# EAGLE board stm v0.4 (EAGLE 9.4.2)
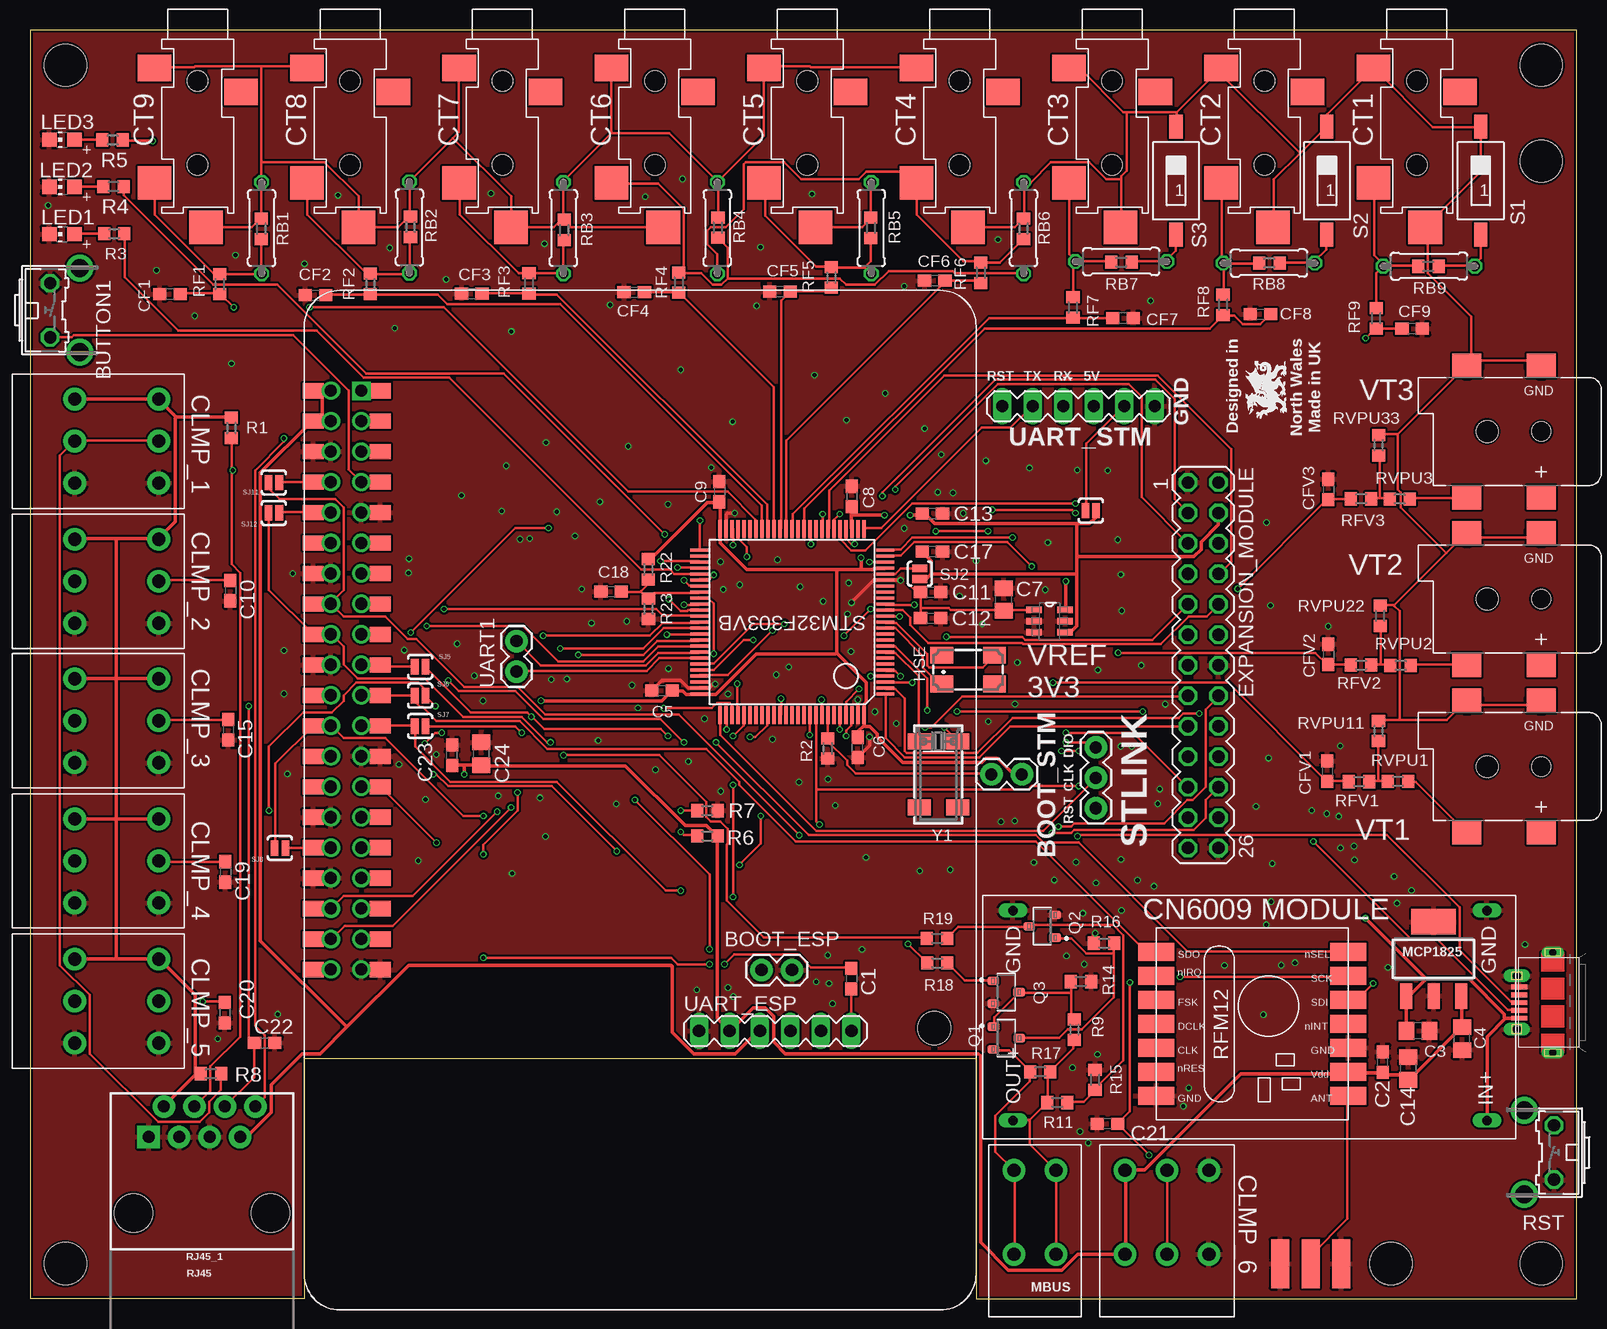
[diagram p2: board, top side]
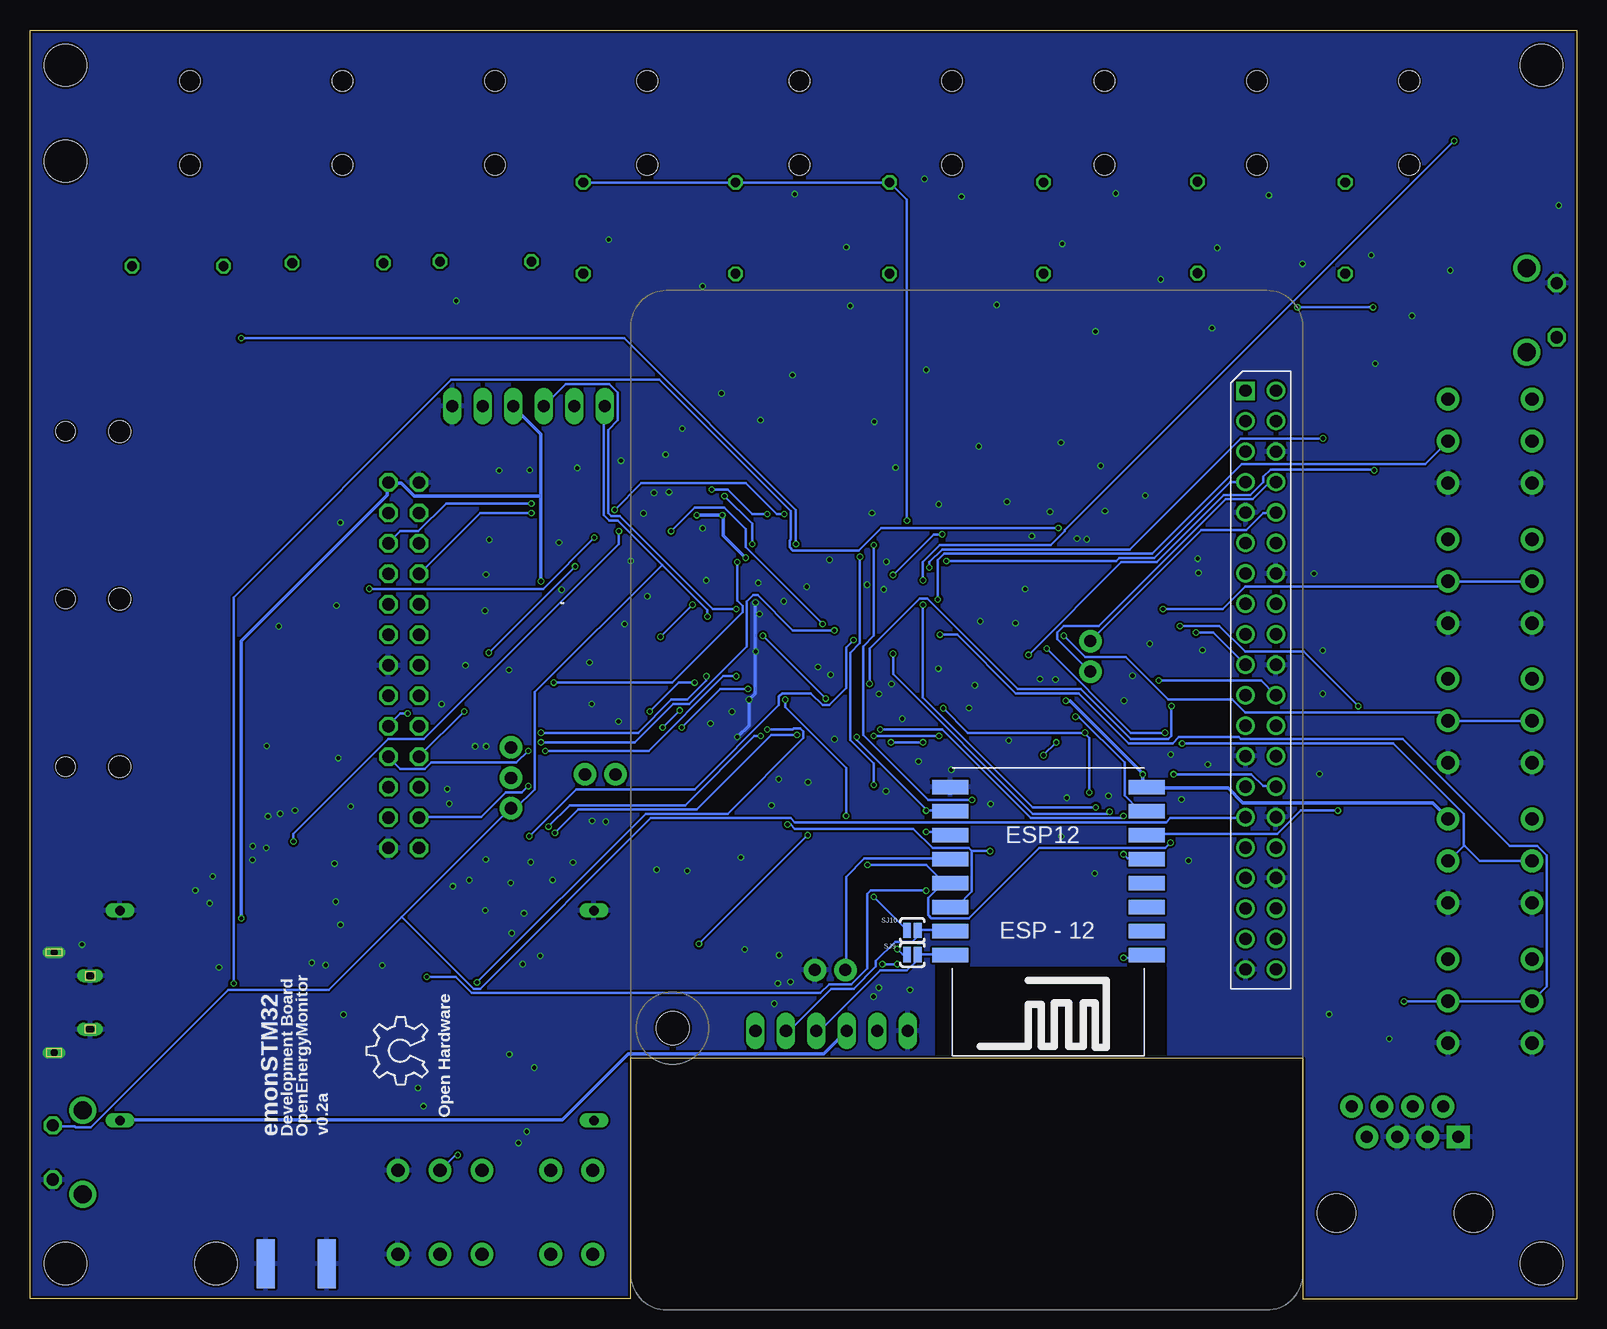
[diagram p3: board, bottom side, seen from below]

Size 128.91 x 105.79 mm. Coordinates in mm from the lower left corner, seen from the top.
Outline: 128.91,105.79 0,105.79 0,0 22.86,0 22.86,20.07 78.87,20.07 78.87,0 128.91,0 128.91,105.79
Copper layers (1*16): Top 0.035mm / dielectric 1.53mm / Bottom 0.035mm
Design rules "jlcpcb *": minimum track width 6mil, minimum drill 0.35mm, track to track 6mil, track to pad 6mil, pad to pad 7mil, via to via 8mil, smd to smd 0mil, copper to edge 8mil, drill to drill 10mil, minimum pad ring 3mil, minimum via ring 3mil, stop-mask expansion 2mil, vias tented up to drill 25mil, thermal gap 8mil
Net classes: 0 default: width 0.203 mm, drill 0.35 mm, clearance 0.152 mm; 1 power: width 0.279 mm, drill 0.35 mm, clearance 0.178 mm; 2 gnd: width 0.254 mm, drill 0.35 mm, clearance 0.152 mm
Holes 3.5 mm at 125.95,102.85 2.95,102.85 2.95,2.95 125.95,2.95 125.95,94.85 113.41,2.95
tRestrict: area 34,19.3 to 53.3,27.7
bRestrict: area 34.2,19.3 to 53.5,27.7

## Footprints (pad centres in the part's own frame; a part is rotated, then mirrored left to right if it is on the bottom)
OMNIMATE_LSF_2 = drill 1.1 pad 1.9: P$1 -3.5,-3.5; P$2 -3.5,3.5; P$3 0,-3.5; P$4 0,3.5
OMNIMATE_LSF_3 = drill 1.1 pad 1.9: P$1 -3.5,-3.5; P$2 -3.5,3.5; P$3 0,-3.5; P$4 0,3.5; P$5 3.5,-3.5; P$6 3.5,3.5
1X02 = drill 1.016 pad 1.88: 1 0,0; 2 2.54,0
B3F-31XX = drill 1.016 octagon: 1 -2.261,-1.245; 2 2.261,-1.245 | drill 1.499 pad 2.159: 3 -3.505,1.245; 4 3.505,1.245
C0603 = smd 1.1 x 1: 1 -0.85,0; 2 0.85,0
C0805 = smd 1.3 x 1.5: 1 -0.95,0; 2 0.95,0
STEREO_SMT = smd 2.8 x 2.2: P$1 -3.6,-2.4; P$3 3.6,-4.4 | smd 2.8 x 2.8: P$2 -3.6,-12; P$4 0.7,-15.7 | hole 1.7: 0,-3.5; 0,-10.5
ESP12-SMD = smd 3 x 1.2: ADC -8.3,3.8; CH_PD -8.3,1.8; GND 8.1,-8.2; GPIO0 8.1,-2.2; GPIO2 8.1,-4.2; GPIO4 8.1,-0.2; GPIO5 8.1,1.8; GPIO12 -8.3,-4.2; GPIO13 -8.3,-6.2; GPIO14 -8.3,-2.2; GPIO15 8.1,-6.2; GPIO16 -8.3,-0.2; RESET -8.3,5.8; RXD0 8.1,3.8; TXD0 8.1,5.8; VCC -8.3,-8.2
MA13-2 = drill 1.016 octagon: 1 -15.24,-1.27; 2 -15.24,1.27; 3 -12.7,-1.27; 4 -12.7,1.27; 5 -10.16,-1.27; 6 -10.16,1.27; 7 -7.62,-1.27; 8 -7.62,1.27; 9 -5.08,-1.27; 10 -5.08,1.27; 11 -2.54,-1.27; 12 -2.54,1.27; 13 0,-1.27; 14 0,1.27; 15 2.54,-1.27; 16 2.54,1.27; 17 5.08,-1.27; 18 5.08,1.27; 19 7.62,-1.27; 20 7.62,1.27; 21 10.16,-1.27; 22 10.16,1.27; 23 12.7,-1.27; 24 12.7,1.27; 25 15.24,-1.27; 26 15.24,1.27
CTS406 = smd 1.9 x 1.4: 1 -2.2,-1.2; 2 2.2,-1.2; 3 2.2,1.2; 4 -2.2,1.2
SMA-EDGE = smd 1.524 x 4.064: GND@0 0,0; GND@1 5.08,0; SIG 2.54,0 | smd 1.524 x 4.064 bottom: GND@2 0,0; GND@3 5.08,0
CHIP-LED0805 = smd 1.2 x 1.2: A 0,-1.05; C 0,1.05
SOT-223 = smd 1 x 2.1: 1 -2.3,-3.1; 2 0,-3.1; 3 2.3,-3.1 | smd 3.7 x 2.1: 4 0,3.1
RPI3MIRROR2 = drill 1.016 square: P$1 8.37,4.775 | drill 1.016: P$2 8.357,2.233; P$3 10.897,4.773; P$4 10.897,2.233; P$5 13.437,4.773; P$6 13.437,2.233; P$7 15.977,4.773; P$8 15.977,2.233; P$9 18.517,4.773; P$10 18.517,2.233; P$11 21.057,4.773; P$12 21.057,2.233; P$13 23.597,4.773; P$14 23.597,2.233; P$15 26.137,4.773; P$16 26.137,2.233; P$17 28.677,4.773; P$18 28.677,2.233; P$19 31.217,4.773; P$20 31.217,2.233; P$21 33.757,4.773; P$22 33.757,2.233; P$23 36.297,4.773; P$24 36.297,2.233; P$25 38.837,4.773; P$26 38.837,2.233; P$27 41.377,4.773; P$28 41.377,2.233; P$29 43.917,4.773; P$30 43.917,2.233; P$31 46.457,4.773; P$32 46.457,2.233; P$33 48.997,4.773; P$34 48.997,2.233; P$35 51.537,4.773; P$36 51.537,2.233; P$37 54.077,4.773; P$38 54.077,2.233; P$39 56.617,4.773; P$40 56.617,2.233 | smd 1.27 x 1.778: P$41 8.371,6.351; P$42 8.371,0.763; P$43 10.911,6.351; P$44 10.911,0.763; P$45 13.451,6.351; P$46 13.451,0.763; P$47 15.991,6.351; P$48 15.991,0.763; P$49 18.531,6.351; P$50 18.531,0.763; P$51 21.071,6.351; P$52 21.071,0.763; P$53 23.611,6.351; P$54 23.611,0.763; P$55 26.151,6.351; P$56 26.151,0.763; P$57 28.691,6.351; P$58 28.691,0.763; P$59 31.231,6.351; P$60 31.231,0.763; P$61 33.771,6.351; P$62 33.771,0.763; P$63 36.311,6.351; P$64 36.311,0.763; P$65 38.851,6.351; P$66 38.851,0.763; P$67 41.391,6.351; P$68 41.391,0.763; P$69 43.931,6.351; P$70 43.931,0.763; P$71 46.471,6.351; P$72 46.471,0.763; P$73 49.011,6.351; P$74 49.011,0.763; P$75 51.551,6.351; P$76 51.551,0.763; P$77 54.091,6.351; P$78 54.091,0.763; P$79 56.631,6.351; P$80 56.631,0.763 | hole 2.75: 61.5,52.505
SOT23 = smd 0.71 x 0.96: 1 -0.95,-1.075; 2 0.95,-1.075; 3 0,1.075
R0603 = smd 1 x 1.1: 1 -0.85,0; 2 0.85,0
0207/7 = drill 0.813 octagon: 1 -3.81,0; 2 3.81,0
RFM12 = smd 1.5 x 3: 1 -5,-10; 2 -3,-10; 3 -1,-10; 4 1,-10; 5 3,-10; 6 5,-10; 7 7,-10; 8 7,6; 9 5,6; 10 3,6; 11 1,6; 12 -1,6; 13 -3,6; 14 -5,6
RJ45-8 = drill 1 pad 1.88 square: 1 -4.445,6.35 | drill 1 pad 1.88: 2 -3.175,8.89; 3 -1.905,6.35; 4 -0.635,8.89; 5 0.635,6.35; 6 1.905,8.89; 7 3.175,6.35; 8 4.445,8.89 | hole 3.2: -5.715,0; 5.715,0
SMS-001 = smd 1.092 x 2.007: 1 0,-4.496; 2 0,4.496
SJ_2S-NO = smd 0.635 x 1.27: 1 -0.45,0; 2 0.45,0
1X03 = drill 1.016 pad 1.88: 1 0,0; 2 2.54,0; 3 5.08,0
TQFP100 = smd 0.27 x 1.5: 1 -6,-7.75; 2 -5.5,-7.75; 3 -5,-7.75; 4 -4.5,-7.75; 5 -4,-7.75; 6 -3.5,-7.75; 7 -3,-7.75; 8 -2.5,-7.75; 9 -2,-7.75; 10 -1.5,-7.75; 11 -1,-7.75; 12 -0.5,-7.75; 13 0,-7.75; 14 0.5,-7.75; 15 1,-7.75; 16 1.5,-7.75; 17 2,-7.75; 18 2.5,-7.75; 19 3,-7.75; 20 3.5,-7.75; 21 4,-7.75; 22 4.5,-7.75; 23 5,-7.75; 24 5.5,-7.75; 25 6,-7.75; 51 6,7.75; 52 5.5,7.75; 53 5,7.75; 54 4.5,7.75; 55 4,7.75; 56 3.5,7.75; 57 3,7.75; 58 2.5,7.75; 59 2,7.75; 60 1.5,7.75; 61 1,7.75; 62 0.5,7.75; 63 0,7.75; 64 -0.5,7.75; 65 -1,7.75; 66 -1.5,7.75; 67 -2,7.75; 68 -2.5,7.75; 69 -3,7.75; 70 -3.5,7.75; 71 -4,7.75; 72 -4.5,7.75; 73 -5,7.75; 74 -5.5,7.75; 75 -6,7.75 | smd 1.5 x 0.27: 26 7.75,-6; 27 7.75,-5.5; 28 7.75,-5; 29 7.75,-4.5; 30 7.75,-4; 31 7.75,-3.5; 32 7.75,-3; 33 7.75,-2.5; 34 7.75,-2; 35 7.75,-1.5; 36 7.75,-1; 37 7.75,-0.5; 38 7.75,0; 39 7.75,0.5; 40 7.75,1; 41 7.75,1.5; 42 7.75,2; 43 7.75,2.5; 44 7.75,3; 45 7.75,3.5; 46 7.75,4; 47 7.75,4.5; 48 7.75,5; 49 7.75,5.5; 50 7.75,6; 76 -7.75,6; 77 -7.75,5.5; 78 -7.75,5; 79 -7.75,4.5; 80 -7.75,4; 81 -7.75,3.5; 82 -7.75,3; 83 -7.75,2.5; 84 -7.75,2; 85 -7.75,1.5; 86 -7.75,1; 87 -7.75,0.5; 88 -7.75,0; 89 -7.75,-0.5; 90 -7.75,-1; 91 -7.75,-1.5; 92 -7.75,-2; 93 -7.75,-2.5; 94 -7.75,-3; 95 -7.75,-3.5; 96 -7.75,-4; 97 -7.75,-4.5; 98 -7.75,-5; 99 -7.75,-5.5; 100 -7.75,-6
BOOST = drill 0.8 long: IN+ 17.5,39.5; OUT+ 17.5,0; P$1 0,0; P$2 0,39.5
MA06-1 = drill 1.016 long: 1 -6.35,0; 2 -3.81,0; 3 -1.27,0; 4 1.27,0; 5 3.81,0; 6 6.35,0
47589-0001 = smd 1.35 x 0.4: 1 2.8,1.3; 2 2.8,0.65; 3 2.8,0; 4 2.8,-0.65; 5 2.8,-1.3 | drill 0.6 pad 0.95 long: CASING1 0,4.175; CASING2 0,-4.175 | drill 0.7 pad 1.1 long: CASING3 3,2.225; CASING4 3,-2.225
SOT95P280X145-6N = smd 1.27 x 0.559: 1 -1.295,0.94; 2 -1.295,0; 3 -1.295,-0.94; 4 1.295,-0.94; 5 1.295,0; 6 1.295,0.94
DCJACK_2MM_SMT = smd 2.4 x 2: GND 0,-5.5; GNDBREAK 6.2,-5.5; PWR1 0,5.5; PWR2 6.2,5.5 | hole 1.6: 0,0 | hole 1.8: 4.5,0
CRYSTAL_8X3.8 = smd 1.3 x 1.9: P$1 -2.75,-1.6; P$2 2.75,-1.6; P$3 2.75,1.6; P$4 -2.75,1.6

## Placement (x,y rotation side)
2POLE_MBUS  OMNIMATE_LSF_2  [OMNIMATE_LSF_2]  85.5,7.24 0 top
3POLE_1  OMNIMATE_LSF_3  [OMNIMATE_LSF_3]  7.23,71.51 270 top
3POLE_2  OMNIMATE_LSF_3  [OMNIMATE_LSF_3]  7.23,59.83 270 top
3POLE_3  OMNIMATE_LSF_3  [OMNIMATE_LSF_3]  7.23,48.2 270 top
3POLE_4  OMNIMATE_LSF_3  [OMNIMATE_LSF_3]  7.23,36.52 270 top
3POLE_5  OMNIMATE_LSF_3  [OMNIMATE_LSF_3]  7.23,24.83 270 top
3POLE_6  OMNIMATE_LSF_3  [OMNIMATE_LSF_3]  94.74,7.24 0 top
BOOT_ESP  [1X02]  60.96,27.43 0 top
BOOT_STM  [1X02]  80.12,43.74 0 top
BUTTON1  [B3F-31XX]  2.92,82.42 270 top
C1  100nF  [C0603]  68.45,26.72 270 top
C2  100nF  [C0603]  112.73,19.75 90 top
C3  4.7uF  [C0805]  115.67,22.35 180 top
C4  4.7uF  [C0805]  119.33,21.71 90 top
C5  100nF  [C0603]  52.67,50.73 0 top
C6  100nF  [C0603]  68.96,45.98 90 top
C7  1uF  [C0805]  81.16,58.31 90 top
C8  100nF  [C0603]  68.48,66.91 270 top
C9  100nF  [C0603]  57.45,67.31 270 top
C10  100nF  [C0603]  16.7,59.06 270 top
C11  10nF  [C0603]  75.06,58.93 0 top
C12  1uF  [C0603]  75.06,56.77 0 top
C13  10nF  [C0603]  75.19,65.49 0 top
C14  1uF  [C0805]  114.87,19.22 90 top
C15  100nF  [C0603]  16.53,47.45 270 top
C17  1uF  [C0603]  75.19,62.32 0 top
C18  10uF  [C0603]  48.43,58.97 0 top
C19  100nF  [C0603]  16.29,35.6 270 top
C20  100nF  [C0603]  16.22,23.88 270 top
C21  100nF  [C0603]  89.79,14.61 180 top
C22  100nF  [C0603]  19.56,21.34 0 top
C23  100nF  [C0603]  35.17,45.33 90 top
C24  47uF  [C0805]  37.62,45.47 90 top
CF1  100nF  [C0603]  11.67,83.78 0 top
CF2  100nF  [C0603]  23.79,83.69 0 top
CF3  100nF  [C0603]  36.81,83.8 0 top
CF4  100nF  [C0603]  50.35,83.94 0 top
CF5  100nF  [C0603]  62.49,83.99 0 top
CF6  100nF  [C0603]  75.4,84.9 0 top
CF7  100nF  [C0603]  91.09,81.75 180 top
CF8  100nF  [C0603]  102.54,82.1 0 top
CF9  100nF  [C0603]  115.18,80.88 180 top
CFV1  100nF  [C0603]  108.1,44 270 top
CFV2  100nF  [C0603]  108.2,53.74 270 top
CFV3  100nF  [C0603]  108.2,67.49 270 top
CT1  STEREO_SMD  [STEREO_SMT]  115.57,105.04 0 top
CT2  STEREO_SMD  [STEREO_SMT]  102.87,105.04 0 top
CT3  STEREO_SMD  [STEREO_SMT]  90.17,105.04 0 top
CT4  STEREO_SMD  [STEREO_SMT]  77.47,105.04 0 top
CT5  STEREO_SMD  [STEREO_SMT]  64.77,105.04 0 top
CT6  STEREO_SMD  [STEREO_SMT]  52.07,105.04 0 top
CT7  STEREO_SMD  [STEREO_SMT]  39.37,105.04 0 top
CT8  STEREO_SMD  [STEREO_SMT]  26.67,105.04 0 top
CT9  STEREO_SMD  [STEREO_SMT]  13.97,105.04 0 top
ESP12  [ESP12-SMD]  44.13,34.47 180 bottom
EXPANSION_MODULE  [MA13-2]  97.77,52.83 270 top
HSE  8MHZ ~15pFmax  [CTS406]  78.18,52.47 0 top
J$1  SMA_EDGE  [SMA-EDGE]  104.18,2.93 0 top
LED1  Red 1.85V  [CHIP-LED0805]  2.67,88.77 90 top
LED2  Red 1.85V  [CHIP-LED0805]  2.67,92.71 90 top
LED3  Red 1.85V  [CHIP-LED0805]  2.67,96.65 90 top
LOGO1  OSHW_LOGO_6MILX0200-NT  [OSHW_6X200_NOTEXT]  95.78,17.86 90 bottom
MCP1825  MCP1825SOT-223-3  [SOT-223]  116.97,28.35 0 top
PCB2  RPI3YA  [RPI3MIRROR2]  22.84,84.09 270 top
Q1  MMBT3906  [SOT23]  81.37,21.75 270 top
Q2  MMBT3904  [SOT23]  84.34,31.07 90 top
Q3  MMBT3904  [SOT23]  81.34,25.58 270 top
R1  4.7k  [R0603]  16.77,72.61 90 top
R2  10k  [R0603]  66.48,45.9 270 top
R3  220R  [R0603]  7.02,88.8 0 top
R4  220R  [R0603]  6.96,92.74 0 top
R5  220R  [R0603]  6.89,96.62 0 top
R6  10k  [R0603]  56.45,38.6 0 top
R7  10k  [R0603]  56.45,40.71 0 top
R8  4.7k  [R0603]  15.07,18.78 180 top
R9  39K  [R0603]  87.03,22.46 270 top
R11  33K  [R0603]  85.61,16.38 180 top
R14  22K  [R0603]  87.57,26.46 180 top
R15  3k3  [R0603]  88.75,18.27 270 top
R16  82R  [R0603]  89.51,29.66 0 top
R17  220K  [R0603]  84.19,18.95 0 top
R18  1K  [R0603]  75.6,28.01 180 top
R19  1K  [R0603]  75.6,30.06 180 top
R22  10k  [R0603]  51.53,60.82 90 top
R23  10k  [R0603]  51.54,57.54 90 top
RB1  22r  [R0603]  19.27,89.22 90 top
RB2  22r  [R0603]  31.71,89.37 90 top
RB3  22r  [R0603]  44.52,89.12 90 top
RB4  22r  [R0603]  57.33,89.31 90 top
RB5  22r  [R0603]  70.07,89.29 90 top
RB6  22r  [R0603]  82.78,89.22 90 top
RB7  22r  [R0603]  90.95,86.43 0 top
RB8  22r  [R0603]  103.28,86.36 0 top
RB9  22r  [R0603]  116.53,86.08 0 top
RB10  22r  [0207/7]  19.3,89.28 90 top
RB11  22r  [0207/7]  31.62,89.33 90 top
RB12  22r  [0207/7]  44.45,89.28 90 top
RB13  22r  [0207/7]  57.28,89.28 90 top
RB14  22r  [0207/7]  70.1,89.28 90 top
RB15  22r  [0207/7]  82.8,89.28 90 top
RB16  22r  [0207/7]  90.93,86.49 0 top
RB17  22r  [0207/7]  103.25,86.36 0 top
RB18  22r  [0207/7]  116.59,86.11 0 top
RF1  330R  [R0603]  15.81,84.6 270 top
RF2  330R  [R0603]  28.36,84.62 270 top
RF3  330R  [R0603]  41.59,84.66 270 top
RF4  330R  [R0603]  54.07,84.73 270 top
RF5  330R  [R0603]  66.78,85.16 270 top
RF6  330R  [R0603]  79.24,85.55 270 top
RF7  330R  [R0603]  86.91,82.65 270 top
RF8  330R  [R0603]  99.42,82.89 270 top
RF9  330R  [R0603]  112.18,81.76 270 top
RFM69HCW  RFM12_SMDSMD  [RFM12]  103.86,23.92 270 top
RFV1  330R  [R0603]  110.75,43.13 180 top
RFV2  330R  [R0603]  110.93,52.85 180 top
RFV3  330R  [R0603]  110.92,66.72 180 top
RJ45_1  RJ45  [RJ45-8]  14.33,7.17 0 top
RST  [B3F-31XX]  125.76,12.21 90 top
RVPU1  120k  [R0603]  114,43.15 0 top
RVPU2  120k  [R0603]  114.22,52.82 0 top
RVPU3  120k  [R0603]  114.15,66.7 180 top
RVPU11  10k  [R0603]  112.38,47.36 90 top
RVPU22  10k  [R0603]  112.52,56.96 90 top
RVPU33  10k  [R0603]  112.39,71.18 90 top
S1  SWS001  [SMS-001]  120.9,93.22 0 top
S2  SWS001  [SMS-001]  108.08,93.22 0 top
S3  SWS001  [SMS-001]  95.5,93.22 0 top
SJ1  SOLDERJUMPERNO  [SJ_2S-NO]  88.4,65.73 0 top
SJ2  SOLDERJUMPERNO  [SJ_2S-NO]  74.15,60.47 90 top
SJ5  SOLDERJUMPERNO  [SJ_2S-NO]  32.51,52.7 180 top
SJ6  SOLDERJUMPERNO  [SJ_2S-NO]  32.51,50.29 180 top
SJ7  SOLDERJUMPERNO  [SJ_2S-NO]  32.51,47.75 180 top
SJ8  SOLDERJUMPERNO  [SJ_2S-NO]  20.83,37.59 180 top
SJ9  SOLDERJUMPERNO  [SJ_2S-NO]  55.37,28.7 0 bottom
SJ10  SOLDERJUMPERNO  [SJ_2S-NO]  55.37,30.73 180 bottom
SJ11  SOLDERJUMPERNO  [SJ_2S-NO]  20.32,68.07 180 top
SJ12  SOLDERJUMPERNO  [SJ_2S-NO]  20.32,65.53 180 top
STLINK  [1X03]  88.82,45.99 270 top
STM32F303VB  STM32F303XB  [TQFP100]  63.5,56.44 90 top
U$2  BOOST_MODULE  [BOOST]  81.92,32.38 270 top
UART1  [1X02]  40.55,52.31 90 top
UART_ESP  [MA06-1]  62.1,22.35 0 top
UART_STM  [MA06-1]  87.37,74.43 180 top
USB_CONN  MICRO-USB-RECEPTACLE47589-0001  [47589-0001]  126.89,24.71 180 top
VREF_3V3  MCP1501T-33E  [SOT95P280X145-6N]  84.96,56.51 0 top
VT1  2.1MMJACKSMT  [DCJACK_2MM_SMT]  125.94,44.38 180 top
VT2  2.1MMJACKSMT  [DCJACK_2MM_SMT]  125.94,58.35 180 top
VT3  2.1MMJACKSMT  [DCJACK_2MM_SMT]  125.94,72.32 180 top
Y1  32.768kHz  [CRYSTAL_8X3.8]  75.7,43.73 270 top

## Tracks (layer width: path | path; a pad name or v marks a point on that pad's centre or on a via)
24V
  Top 0.203: R9.2 86.94,21.6 86.94,20.89 85.08,19.02 R17.2 84.99,18.94 84.81,18.76 84.81,16.45 R11.2 84.72,16.36 83.3,14.94 | 83.3,14.94 81.97,14.94 U$2.OUT+ | 2POLE_MBUS.P$3 85.52,3.82 85.52,10.67 2POLE_MBUS.P$4 85.43,10.76 83.3,12.89 83.3,14.94
+3V3  (via drill 0.35)
  Top 0.279: 75.12,60.45 75.12,61.52 74.41,62.23 C17.1 | 75.12,60.45 74.77,60.1 74.23,60.1 SJ2.1 | 68.45,65.34 68.45,64.28 STM32F303VB.28 | 68.45,65.34 68.45,66.05 C8.2 | 87.21,64.63 88.28,64.63 88.81,65.16 88.81,65.7 SJ1.2 | 87.21,64.63 75.39,64.63 74.59,65.43 74.41,65.43 C13.1 74.32,65.34 v73.34,65.34 | 87.21,64.63 87.21,61.87 | 87.21,61.87 87.21,60.45 | 87.21,60.45 87.21,56.1 86.77,55.65 86.32,55.65 VREF_3V3.4 | v71.21,65.34 68.45,65.34 | 87.21,60.45 75.12,60.45 | 87.21,61.87 96.99,61.87 97.61,62.5 97.61,63.12 99.03,64.54 EXPANSION_MODULE.4 | 69.52,47.83 68.99,47.3 68.99,46.85 C6.2 | 69.52,47.83 69.52,48.63 STM32F303VB.100 69.52,48.81 69.52,49.61 69.7,49.78 69.7,51.38 67.21,53.87 | R22.2 51.56,61.7 51.74,61.7 56.45,66.41 57.43,66.41 C9.2 57.52,66.32 57.52,64.28 STM32F303VB.50 57.52,64.1 57.52,63.03 59.74,60.81 67.21,60.81 | 67.21,60.81 69.25,60.81 | 69.25,60.81 70.23,60.81 70.32,60.9 71.21,60.9 STM32F303VB.22 | 67.21,60.81 67.21,53.87 | 67.21,53.87 67.12,53.78 60.54,53.78 57.16,50.41 55.83,50.41 STM32F303VB.75 55.74,50.41 54.67,50.41 54.41,50.67 53.61,50.67 C5.2 53.43,50.67 52.63,49.87 v42.58,49.87 | BOOT_STM.2 82.59,43.83 81.88,43.83 80.63,45.07 79.65,45.07 79.3,44.72 72.72,44.72 70.59,46.85 70.59,47.12 69.96,47.74 69.61,47.74 69.52,47.83 | 69.25,60.81 v69.25,61.78 | MCP1825.3 119.3,25.25 119.3,22.67 C4.2 119.24,22.6 114.92,18.27 C14.1 114.34,18.7 113.08,18.7 C2.1 112.64,18.85 109.88,18.85 RFM69HCW.9 109.79,18.76 100.9,18.76 92.9,10.76 91.39,10.76 3POLE_6.P$2 91.3,10.67 91.3,3.82 3POLE_6.P$1 91.12,3.73 87.3,3.73 85.97,2.4 81.52,2.4 79.21,4.71 79.21,20.27 79.03,20.45 62.94,20.45 61.96,21.43 61.96,23.56 61.25,24.27 60.27,24.27 58.41,22.4 UART_ESP.2 58.23,22.4 57.25,23.38 57.25,38.58 R6.2 57.16,38.67 56.36,39.47 54.59,39.47 49.61,44.45 37.69,44.45 C24.1 37.6,44.54 36.18,44.54
  Top 0.279: 36.18,44.54 35.2,44.54 C23.1 | v36.18,43.74 36.18,44.54 | 7.2,40.01 10.67,40.01 3POLE_4.P$2 | 7.2,40.01 3.73,40.01 3POLE_4.P$1 | RJ45_1.2 11.2,16.09 13.87,18.76 14.13,18.76 R8.2 13.78,18.85 13.78,25.34 10.85,28.27 3POLE_5.P$2 10.67,28.36 7.2,28.36 | 7.2,28.36 3.73,28.36 3POLE_5.P$1 | 7.2,28.36 7.2,40.01 | 12.18,73.52 16.71,73.52 R1.2 | 12.18,73.52 10.76,74.94 3POLE_1.P$2 10.67,75.03 3.73,75.03 3POLE_1.P$1 | 7.2,51.74 10.67,51.74 3POLE_3.P$2 | 7.2,51.74 3.73,51.74 3POLE_3.P$1 | 7.2,63.39 10.67,63.39 3POLE_2.P$2 10.76,63.48 12.09,64.81 12.09,73.43 12.18,73.52 | 7.2,63.39 3.73,63.39 3POLE_2.P$1 | 7.2,63.39 7.2,51.74 | 7.2,51.74 7.2,40.01
  Bottom 0.279: v73.34,65.34 v71.21,65.34 71.12,65.25 71.12,63.65 v69.25,61.78 | 3POLE_4.P$2 10.76,40.09 12,41.34 27.83,41.34 29.07,42.58 35.74,42.58 ESP12.VCC 35.92,42.67 36.18,42.94 v36.18,43.74 36.18,43.83 42.23,49.87 v42.58,49.87
+3V3_ADC
  Top 0.203: VREF_3V3.1 83.66,57.43 81.17,57.43 C7.1 81.08,57.43 76.72,57.43 76.54,57.61 74.23,57.61 | 74.23,57.61 74.23,58.85 C11.1 74.14,58.94 73.88,58.94 73.17,59.65 73.17,60.9 | 74.23,57.61 74.23,56.81 C12.1 | 73.17,60.9 72.54,60.9 72.1,60.45 71.3,60.45 STM32F303VB.21 | 73.17,60.9 74.14,60.9 SJ2.2
+5V  (via drill 0.35)
  Top 0.279: v86.32,59.83 86.32,57.52 VREF_3V3.6 | C3.2 114.68,22.4 MCP1825.1 114.77,25.34 115.04,25.34 116.37,26.67 | 122.95,23.38 124.02,23.38 USB_CONN.1 | 122.95,23.38 121.44,21.87 121.44,14.94 U$2.IN+ | 116.37,26.67 119.93,26.67 122.86,23.74 122.86,23.47 122.95,23.38 | PCB2.P$42 23.65,75.74 25.07,75.74 PCB2.P$2 24.36,75.65 24.36,73.34 PCB2.P$4 25.07,73.25 23.65,73.25 PCB2.P$44 23.47,73.17 19.2,68.9 19.2,29.87 26.4,22.67 | 26.4,22.67 24.18,20.45 22.67,20.45 20.09,17.87 20.09,15.56 18.14,13.6 17.51,13.6 RJ45_1.7 | 26.4,22.67 31.56,27.83 53.43,27.83 53.52,27.74 53.52,22.23 55.3,20.45 58.76,20.45 60.63,22.31 60.81,22.31 UART_ESP.3 | 116.37,26.67 v111.3,31.74
  Bottom 0.279: 86.32,66.94 86.32,72.1 88.63,74.41 UART_STM.3 | 86.32,66.94 v86.32,59.83 | 86.32,66.94 96.9,66.94 97.97,68.01 99.03,68.01 EXPANSION_MODULE.2 99.12,67.92 99.12,67.03 111.3,54.85 v111.3,31.74 | U$2.IN+ 121.35,14.94 84.54,14.94 79.03,20.45 62.76,20.45 60.9,22.31 UART_ESP.3
AC1
  Top 0.203: RVPU1.2 114.86,43.12 115.48,43.12 119.66,38.94 VT1.PWR2
AC2
  Top 0.203: RVPU2.2 115.13,52.9 119.66,52.9 VT2.PWR2
AC3
  Top 0.203: RVPU3.1 115.04,66.76 119.66,66.76 VT3.PWR2
ADC0
  Top 0.203: 112.46,66.76 111.84,66.76 RFV3.1 | 112.46,66.76 113.26,66.76 RVPU3.2 | 112.46,66.76 112.46,70.32 RVPU33.1
ADC_RJ45IN  (via drill 0.35)
  Top 0.203: v53.96,60.98 55.74,60.98 STM32F303VB.54 | v21.16,71.74 21.16,71.48 18.76,69.08 18.76,22.76 19.56,21.96 19.56,16.8 18.85,16.09 RJ45_1.8
  Bottom 0.203: v53.96,60.98 53.96,61.43 52.9,62.5 37.25,62.5 28,71.74 v21.16,71.74
ANT
  Top 0.203: RFM69HCW.8 109.79,16.89 109.79,6.67 106.77,3.65 106.77,2.93 J$1.SIG
BIAS  (via drill 0.35)
  Top 0.203: CT9.P$4 14.76,89.34 18.49,89.34 19.2,90.06 RB1.2 19.29,90.14 19.29,93.08 RB10.2 19.29,93.17 19.29,94.77 | 19.29,102.77 22.94,102.77 23.02,102.68 CT8.P$1 | 19.29,102.77 13.78,102.77 13.69,102.68 10.4,102.68 CT9.P$1 | 19.29,102.77 19.29,94.77 | 35.25,96.77 31.65,93.17 RB11.2 31.65,93.08 31.65,90.23 RB2.2 31.56,90.23 30.67,89.34 27.38,89.34 CT8.P$4 27.38,89.43 27.38,91.92 24.54,94.77 19.29,94.77 | 35.25,96.77 35.74,97.26 35.74,102.59 CT7.P$1 | RB3.2 44.45,90.06 RB12.2 44.45,93.17 48.45,97.17 | RB3.2 44.36,90.06 43.65,89.34 40.09,89.34 CT7.P$4 40.09,89.43 40.09,91.92 35.25,96.77 | CT6.P$4 52.72,89.34 45.07,89.34 44.54,89.88 RB3.2 | 48.45,97.17 48.45,102.59 CT6.P$1 | RB4.2 57.34,90.23 57.34,93.08 RB13.2 | v55.83,64.9 55.83,62.5 STM32F303VB.51 | RB13.2 57.34,93.17 61.16,96.99 61.16,102.59 CT5.P$1 61.25,102.68 61.34,102.77 64.99,102.77 65.08,102.68 73.79,102.68 CT4.P$1 | 48.45,97.17 53.25,97.17 57.25,93.17 RB13.2 | 113.97,72.1 112.46,72.1 RVPU33.2 | 113.97,72.1 119.66,77.79 VT3.GNDBREAK | VT3.GND 125.88,77.88 125.08,77.88 124.73,78.23 120.1,78.23 119.75,77.88 VT3.GNDBREAK | 114.15,48.27 118.06,48.27 119.66,49.87 VT1.GNDBREAK 119.84,49.87 120.19,49.52 124.73,49.52 125.08,49.87 125.88,49.87 VT1.GND | 114.15,48.27 112.46,48.27 RVPU11.2 | 113.7,57.87 112.55,57.87 RVPU22.2 | 118.02,62.19 119.66,63.83 VT2.GNDBREAK 119.84,63.83 120.19,63.48 124.73,63.48 125.08,63.83 125.88,63.83 VT2.GND | 118.02,62.19 113.7,57.87 | 114.15,48.27 114.15,57.34 113.7,57.78 113.7,57.87 | 113.97,72.1 113.97,67.47 114.24,67.21 114.24,65.96 118.02,62.19 | 105.83,95.52 108.01,97.7 S2.2 108.1,97.79 108.1,98.77 111.92,102.59 CT1.P$1 112.01,102.59 116.9,97.7 120.81,97.7 S1.2 120.9,93.97 116.28,89.34 CT1.P$4 116.28,89.26 116.46,89.08 116.46,85.52 120.1,81.88 120.1,78.32 VT3.GNDBREAK
  Top 0.203: 105.83,95.52 103.66,93.34 103.66,89.34 CT2.P$4 | RB14.2 70.05,93.08 70.05,90.23 RB5.2 70.05,90.06 69.34,89.34 65.52,89.34 CT5.P$4 | CT4.P$4 78.23,89.34 82.06,89.34 82.77,90.06 RB6.2 82.86,90.14 82.86,93.08 RB15.2 82.94,93.08 83.39,93.08 85.08,94.77 88.28,94.77 89.7,93.34 90.94,93.34 | 95.57,98.95 95.57,97.79 S3.2 | 95.57,98.95 99.21,102.59 CT2.P$1 99.03,102.32 105.83,95.52 | 95.57,98.95 91.39,98.95 | 91.39,98.95 91.12,98.95 87.48,102.59 86.59,102.59 CT3.P$1 | 90.94,93.34 90.94,93.61 91.39,94.06 91.39,98.95 | 90.94,93.34 90.94,89.34 CT3.P$4
  Bottom 0.203: v55.83,64.9 55.83,91.66 57.25,93.08 RB13.2 57.34,93.08 70.05,93.08 RB14.2 70.14,93.08 82.77,93.08 RB15.2
BIAS_IN
  Top 0.203: 50.94,58.94 49.34,58.94 C18.2 | 50.94,58.94 51.47,58.41 R23.2 51.56,58.41 52.01,58.85 55.74,58.85 STM32F303VB.58 | R22.1 51.47,59.92 51.47,59.56 50.94,59.03 50.94,58.94
BOOT0
  Top 0.203: STM32F303VB.94 66.5,48.63 66.5,46.76 R2.1 66.5,46.67 66.5,46.49 68.1,44.9 68.1,44.54 68.81,43.83 80.1,43.83 BOOT_STM.1
BUTTON1  (via drill 0.35)
  Top 0.203: v52.54,61.52 55.74,61.52 STM32F303VB.53 | PCB2.P$47 29.16,68.1 27.65,68.1 PCB2.P$7 27.56,68.19 26.58,69.16 26.58,75.74 21.96,80.37 3.65,80.37 3.47,80.19 1.69,80.19 BUTTON1.2
  Bottom 0.203: v52.54,61.52 38.41,61.52 38.14,61.78 35.2,61.78 28.89,68.1 27.65,68.1 PCB2.P$7
CS_RFM69  (via drill 0.35)
  Top 0.203: PCB2.P$62 23.65,50.32 25.07,50.32 PCB2.P$22 | v57.16,46.41 64.9,38.67 83.83,38.67 84.45,38.05 87.39,38.05 96.46,28.98 109.79,28.98 RFM69HCW.14 | v54.5,46.41 52.54,48.36 42.76,48.36 40.45,50.67 35.74,50.67 v34.85,51.56
  Bottom 0.203: v54.5,46.41 v57.16,46.41 | v34.85,51.56 26.31,51.56 25.16,50.41 PCB2.P$22
CT1  (via drill 0.35)
  Top 0.203: CF1.2 12.54,83.83 15.73,83.83 RF1.2 15.91,83.74 v16.98,82.68 | v23.29,82.68 34.49,82.68 49.87,67.3 58.14,67.3 60.45,64.99 60.45,64.28 STM32F303VB.44
  Bottom 0.203: v16.98,82.68 v23.29,82.68
CT1_EX  (via drill 0.35)
  Top 0.203: v68.72,62.94 68.45,62.94 68.01,63.39 STM32F303VB.29 | v71.03,66.94 71.03,67.21 80.45,76.63 93.79,76.63 95.39,75.03 95.39,66.67 96.46,65.61 EXPANSION_MODULE.3
  Bottom 0.203: v68.72,62.94 68.72,64.63 v71.03,66.94
CT2
  Top 0.203: CF2.2 24.71,83.74 28.36,83.74 RF2.2 28.45,83.74 33.96,83.74 34.76,82.94 44.18,82.94 60.98,66.14 60.98,64.28 STM32F303VB.43
CT2_EX  (via drill 0.35)
  Top 0.203: v87.12,66.32 73.52,66.32 69.61,62.41 68.45,62.41 67.56,63.3 67.56,64.19 STM32F303VB.30
  Bottom 0.203: v87.12,66.32 94.23,66.32 96.55,64.01 98.06,64.01 99.03,63.03 EXPANSION_MODULE.6
CT3
  Top 0.203: CF3.2 37.69,83.83 41.52,83.83 RF3.2 41.6,83.74 43.92,83.74 61.43,66.23 61.43,64.28 STM32F303VB.42
CT3_EX  (via drill 0.35)
  Top 0.203: v67.47,65.43 67.03,64.99 67.03,64.28 STM32F303VB.31 | v72.1,67.47 72.1,67.74 80.63,76.28 91.57,76.28 92.63,75.21 92.63,66.85 96.46,63.03 EXPANSION_MODULE.5
  Bottom 0.203: v67.47,65.43 68.72,65.43 70.76,67.47 v72.1,67.47
CT4
  Top 0.203: CF4.2 51.21,83.92 54.05,83.92 RF4.2 54.14,83.83 61.96,76.01 61.96,64.28 STM32F303VB.41
CT4_EX
  Top 0.203: STM32F303VB.32 66.59,64.28 66.59,67.39 76.19,76.99 93.97,76.99 100.1,70.85 100.1,61.43 99.12,60.45 EXPANSION_MODULE.8
CT5
  Top 0.203: RF5.2 66.76,84.28 66.5,84.01 63.39,84.01 CF5.2 63.3,83.92 62.59,83.21 62.59,64.28 STM32F303VB.40
CT5_EX  (via drill 0.35)
  Top 0.203: v66.05,65.43 66.05,64.28 STM32F303VB.33 | v80.19,65.79 86.86,65.79 v87.12,65.52
  Bottom 0.203: v66.05,65.43 66.67,65.43 69.25,68.01 77.97,68.01 v80.19,65.79 | v87.12,65.52 91.39,65.52 96.46,60.45 EXPANSION_MODULE.7
CT6
  Top 0.203: RF6.2 79.21,84.72 79.03,84.9 76.28,84.9 CF6.2 76.28,84.81 63.03,71.56 63.03,64.28 STM32F303VB.39
CT6_EX
  Top 0.203: STM32F303VB.15 71.3,57.43 72.72,57.43 73.34,56.81 73.34,56.19 74.85,54.67 82.68,54.67 82.77,54.59 94.23,54.59 96.55,56.9 98.06,56.9 99.03,57.87 EXPANSION_MODULE.10
CT7
  Top 0.203: CF7.2 90.23,81.79 86.94,81.79 RF7.2 86.86,81.79 79.92,81.79 63.56,65.43 63.56,64.28 STM32F303VB.38
CT7_EX  (via drill 0.35)
  Top 0.203: v73.7,57.87 71.3,57.87 STM32F303VB.16 | v76.36,55.21 82.68,55.21 82.94,54.94 93.52,54.94 96.46,57.87 EXPANSION_MODULE.9
  Bottom 0.203: v76.36,55.21 v73.7,57.87
CT8
  Top 0.203: CF8.2 103.3,82.06 102.5,81.25 101.08,81.25 100.37,81.97 99.48,81.97 RF8.2 99.39,81.97 98.32,80.9 79.57,80.9 64.54,65.88 64.54,64.28 STM32F303VB.36
CT9  (via drill 0.35)
  Top 0.203: CF9.2 114.33,80.9 112.19,80.9 RF9.2 112.1,80.9 v111.3,80.1 | v65.08,62.94 65.08,64.19 STM32F303VB.35
  Bottom 0.203: v65.08,62.94 65.08,65.79 79.39,80.1 v111.3,80.1
D+  (via drill 0.35)
  Top 0.203: v87.3,38.58 87.39,38.67 113.08,38.67 119.13,32.63 119.13,29.07 123.39,24.8 124.02,24.8 USB_CONN.3 | v60.27,54.94 59.47,54.94 56.98,52.45 55.83,52.45 STM32F303VB.71
  Bottom 0.203: v87.3,38.58 83.39,42.49 73.52,42.49 66.5,49.52 66.5,50.23 66.23,50.49 63.83,50.49 62.85,49.52 62.32,49.52 60.9,50.94 60.9,54.32 v60.27,54.94
D-  (via drill 0.35)
  Top 0.203: v106.95,38.14 115.04,30.05 117.17,30.05 123.13,24.09 124.02,24.09 USB_CONN.2 | v75.48,64.01 v79.83,64.01 | v62.85,56.27 60.27,56.27 56.98,52.98 55.83,52.98 STM32F303VB.70
  Bottom 0.203: v106.95,38.14 106.95,38.76 99.03,46.67 96.1,46.67 79.83,62.94 v79.83,64.01 | v75.48,64.01 73.52,65.96 71.03,65.96 69.25,64.19 69.25,62.67 v62.85,56.27
DS18B20_2  (via drill 0.35)
  Top 0.203: v53.25,58.32 54.23,57.34 54.76,57.34 54.85,57.43 STM32F303VB.61 | R8.1 15.91,18.76 15.91,17.42 14.94,16.45 14.94,15.56 14.13,14.76 10.67,14.76 4.98,20.45 4.98,25.34 2.49,27.83 2.49,70.32 3.65,71.48 3POLE_1.P$3 3.82,71.56 10.67,71.56 3POLE_1.P$4
  Bottom 0.203: v53.25,58.32 53.25,61.61 52.72,62.14 35.38,62.14 27.91,69.61 12.62,69.61 10.76,71.48 3POLE_1.P$4
DS18B20_RJ45  (via drill 0.35)
  Top 0.203: 16.8,69.08 16.8,61.25 17.51,60.54 17.51,21.87 15.02,19.38 15.02,17.34 13.78,16.09 RJ45_1.4 | 16.8,69.08 16.8,71.74 R1.1 | v45.7,53.7 51.12,53.7 52.27,54.85 55.74,54.85 STM32F303VB.66 | v16.89,69.08 16.8,69.08
  Bottom 0.203: v45.7,53.7 37.96,61.43 35.03,61.43 29.43,67.03 27.2,67.03 26.14,68.1 26.14,68.54 25.51,69.16 16.98,69.16 v16.89,69.08
GND  (via drill 0.35)
  Top 0.279: C5.1 51.83,50.76 52.63,51.56 54.23,51.56 54.85,50.94 STM32F303VB.74 55.8,50.98 56.63,50.98 56.91,51.26 v57.11,51.26 | v68.99,49.96 68.99,48.72 STM32F303VB.99 | v69.96,46.85 69.96,46.14 68.99,45.16 C6.1 | v68.45,58.05 70.32,59.92 71.21,59.92 STM32F303VB.20 72.52,59.94 v72.55,59.91 | STM32F303VB.49 58,64.35 58,64.37 58,64.38 58,65.41 58.1,65.51 v58.73,65.51 | R16.1 88.66,30.39 v88.77,30.5
  Bottom 0.279: v69.96,46.85 68.99,47.83 v68.99,49.96 68.45,50.49 v68.45,58.05
  other vias: 60.55,82.79 72.85,84.44 48.34,82.87 45.98,59.18 49.72,56.5 50.16,51.17 53.21,52.55 52.12,44.12 57.56,42.33 66.51,43.34 64.08,43.09 67.11,41.14 69.67,36.81 80.92,39.8 82.06,39.85 85.35,34.92 115.12,34.06 109.18,46.1 108.18,56.09 68.12,57.11 77.46,58.58 84.6,59.12 21.9,60.47 31.54,60.53 31.59,61.72 35.96,66.99 42.99,71.4 39.69,69.45 56.77,69.31 86.38,28.6 87.74,32.15 68.22,59.7 66.09,58.16 64.18,59.38 79.35,56.26 82.28,53.06 88.99,52.44 92.61,52.82 94.14,42.51 102.17,41.07 103.53,36.3 103.22,45.09 105.42,28.03 99.54,27.82 103.43,33.12 124.58,29.55 93.97,41.29 90.89,46.07 91.81,46.07 93.39,83.2 34.68,85 22.87,86.3 10.54,85.76 13.73,81.96 30.4,80.93 40.11,80.66 16.8,77.98 1.51,91.16 41.65,63.4 45.42,63.61 43.9,65.63 47.49,66.46 40.84,63.33 39.32,65.68 49.85,71.08 58.55,73.13 54.22,77.46 65.37,77.03 68.04,73.27 71.27,75.5 74.55,72.57 75.94,70.39 79.66,69.89 83.3,69.28 89.81,69.07 90.64,63.3 78.84,61.53 77.77,65.5 76.91,67.21 75.65,67.26 72.85,64.25 50.66,49.28 43.44,51.65 44.74,51.68 46.79,56.34 62.19,52.05 56.21,48.37 61.87,46.67 54.86,44.82 48.85,41.26 42.51,41.78 42.96,38.56 96.57,17.59 96.11,16.07 87.51,13.96 88.2,13.01 88.96,20.39 86.88,19.29 87.85,27.92 90.96,32.4 88.84,34.68 92.3,34.92 93.66,34.41 15.64,21.69 20.65,23.74 87.26,69.1 84.82,63.05 90.91,60.39 90.98,57.37 103.37,57.81 103.04,64.73 21.17,54.06 21.17,50.45 33.85,45.4 30.75,44.56 32.95,41.64 32.36,36.54 40.18,35.48 39.03,41.95 21.45,43.77 65.53,26.44 58.61,25.21 55.57,25.77 58.17,25.97 66.88,24.63 66.58,26.32 66.48,28.67 69.34,29.15 35.59,54.62 37.03,51.96 94.6,49.59 82.09,49.61 79.86,48.15 72.19,47.98 70.4,48.96 68.42,53.97 58.16,50.43 57.76,59.16 59.15,59.54 57.54,61.46 62.29,61.63 63.24,52.68 60.87,87.68 65.17,92.11 54.37,93.37 51.27,91.9 42.88,87.97 38.42,92.17 29.97,87.63 25.67,92.01 80.67,88.31 17.13,87.02 53.17,66.24 37.75,49.88 31.19,54.09 47.35,46.56 83.66,36.39 87.17,36.42 90.91,36.64 76.69,35.79 74.14,35.68 103.02,31.2 102.78,23.7 104.27,27.83 113.16,27.65 113.92,32.99 113.68,35.23 109.22,37.6 110.37,36.6 110.34,37.75 108.06,40.45 109.06,40.24 106.82,40.73
  pour Top (isolate 0.178): 139.22,-7.21 -8.73,-7.21 -8.73,108.6 139.22,108.6
  pour Bottom: -13.44,110.63 -13.44,-9.99 141.99,-9.99 141.99,110.63
HSE_IN
  Top 0.203: STM32F303VB.12 71.3,55.92 72.1,55.92 74.41,53.61 74.41,52.63 75.74,51.3 75.92,51.3 HSE.1
HSE_OUT
  Top 0.203: STM32F303VB.13 71.3,56.36 72.19,56.36 74.77,53.78 74.77,52.81 74.94,52.63 79.39,52.63 80.37,53.61 HSE.3
IO1_EX  (via drill 0.35)
  Top 0.203: v69.08,50.85 68.01,49.78 68.01,48.72 STM32F303VB.97 | v74.59,47.65 75.12,47.65 77.7,50.23 96.46,50.23 EXPANSION_MODULE.15
  Bottom 0.203: v69.08,50.85 71.39,50.85 v74.59,47.65
IO2_EX  (via drill 0.35)
  Top 0.203: v68.01,46.94 68.01,47.38 68.45,47.83 68.45,48.63 STM32F303VB.98 | v85.7,39.38 86.77,39.38 87.03,39.65 94.5,39.65 96.46,41.6 96.9,41.6 97.97,42.67 97.97,49.16 99.03,50.23 EXPANSION_MODULE.16
  Bottom 0.203: v68.01,46.94 68.54,46.94 74.32,41.16 83.92,41.16 v85.7,39.38
IO3_EX
  Top 0.203: STM32F303VB.1 71.3,50.41 71.3,46.76 72.9,45.16 79.12,45.16 81.7,47.74 96.46,47.74 EXPANSION_MODULE.17
IO4_EX  (via drill 0.35)
  Top 0.203: v97.43,48.81 96.1,48.81 95.75,48.45 81.88,48.45 78.94,45.52 73.08,45.52 72.9,45.7 72.9,50.05 72.1,50.85 71.3,50.85 STM32F303VB.2
  Bottom 0.203: v97.43,48.81 98.06,48.81 99.03,47.83 EXPANSION_MODULE.18
IO5_EX  (via drill 0.35)
  Top 0.203: v73.52,51.38 71.3,51.38 STM32F303VB.3 | v92.72,48.98 v77.25,48.98
  Bottom 0.203: v73.52,51.38 74.85,51.38 v77.25,48.98 | v92.72,48.98 96.46,45.25 EXPANSION_MODULE.19
IO6_EX  (via drill 0.35)
  Top 0.203: v70.05,51.92 71.21,51.92 STM32F303VB.4 | v87.39,45.7 v85.97,45.7
  Bottom 0.203: v70.05,51.92 71.12,51.92 77.34,45.7 v85.97,45.7 | v87.39,45.7 88.37,44.72 95.48,44.72 96.01,44.18 98.06,44.18 99.03,45.16 EXPANSION_MODULE.20
IO7_EX  (via drill 0.35)
  Top 0.203: v72.54,51.92 72.1,52.36 71.3,52.36 STM32F303VB.5 | v86.32,47.21 91.92,47.21 96.46,42.67 EXPANSION_MODULE.21
  Bottom 0.203: v72.54,51.92 72.54,51.56 74.14,49.96 75.48,49.96 78.23,47.21 v86.32,47.21
IO8_EX  (via drill 0.35)
  Top 0.203: v64.99,47.03 64.99,48.63 STM32F303VB.91 | v85.17,38.85 86.77,38.85 87.03,39.12 96.99,39.12 97.97,40.09 97.97,41.6 EXPANSION_MODULE.22
  Bottom 0.203: v64.99,47.03 67.12,47.03 73.34,40.8 83.21,40.8 v85.17,38.85
LED1
  Top 0.203: R3.2 7.91,88.72 7.91,85.17 12.36,80.72 23.91,80.72 27.83,76.81 34.94,76.81 50.94,60.81 53.34,60.81 53.7,60.45 55.74,60.45 STM32F303VB.55
LED2  (via drill 0.35)
  Top 0.203: v52.9,63.74 39.47,77.17 28,77.17 20.62,84.54 15.29,84.54 7.82,92.01 7.82,92.72 R4.2 | v56.98,60.36 56.63,60.01 55.83,60.01 STM32F303VB.56
  Bottom 0.203: v52.9,63.74 53.61,63.74 v56.98,60.36
LED3  (via drill 0.35)
  Top 0.203: v10.22,96.55 7.82,96.55 R5.2 | v54.5,59.92 54.94,59.47 55.74,59.47 STM32F303VB.57
  Bottom 0.203: v10.22,96.55 42.67,64.1 42.67,64.01 43.83,62.85 53.07,62.85 54.5,61.43 v54.5,59.92
MBUS_RX  (via drill 0.35)
  Top 0.203: v73.17,29.6 74.68,28.09 R18.2 | v64.1,38.67 54.05,48.72 42.94,48.72 40.63,51.03 36.18,51.03 32.18,55.03 31.47,55.03 29.6,56.9 26.14,56.9 25.16,57.87 PCB2.P$16 | SJ11.2 19.91,68.01 19.91,67.56 20.8,66.67 25.43,66.67 26.14,65.96 26.14,59.12 25.07,58.05 PCB2.P$16 | PCB2.P$56 23.65,57.96 24.98,57.96 PCB2.P$16
  Bottom 0.203: v64.1,38.67 v73.17,29.6
MBUS_TX  (via drill 0.35)
  Top 0.203: SJ12.2 19.91,65.52 19.91,59.12 23.56,55.47 PCB2.P$58 23.65,55.38 24.98,55.38 PCB2.P$18 25.16,55.38 26.14,54.41 26.14,52.9 27.29,51.74 32.89,51.74 36.09,48.54 40.98,48.54 43.12,46.41 v43.38,46.41 | v44.45,45.34 52.45,45.34 56.36,41.43 56.36,40.18 56.72,39.83 57.52,39.83 58.14,39.2 58.14,37.96 58.05,37.87 58.05,33.25 61.16,30.14 74.68,30.14 R19.2
  Bottom 0.203: v43.38,46.41 v44.45,45.34
MISO
  Top 0.203: PCB2.P$21 27.65,50.32 29.16,50.32 PCB2.P$61 29.25,50.32 32,50.32 SJ6.2 32.09,50.23 32.09,49.78 32.54,49.34 32.72,49.34 33.87,48.18 40.8,48.18 43.12,45.87 56.36,45.87 59.12,43.12 59.12,42.85 63.83,38.14 83.83,38.14 92.99,28.98 93.79,28.98 RFM69HCW.1
MOSI  (via drill 0.35)
  Top 0.203: SJ5.2 32,52.72 29.34,52.72 29.25,52.81 PCB2.P$59 29.16,52.9 27.65,52.9 PCB2.P$19 | v111.92,26.31 110.59,24.98 109.88,24.98 RFM69HCW.12 | v43.2,64.28 40.45,64.28 v31.74,55.56
  Bottom 0.203: v111.92,26.31 111.92,58.5 93.79,76.63 76.45,76.63 65.52,65.7 65.52,63.3 65.61,63.21 65.61,62.67 65.34,62.41 59.83,62.41 57.96,64.28 v43.2,64.28 | v31.74,55.56 30.32,55.56 27.65,52.9 PCB2.P$19
N$1
  Top 0.203: SJ1.1 88.01,65.79 88.01,71.3 91.12,74.41 UART_STM.2
N$2
  Top 0.203: RB1.1 19.29,88.37 19.29,85.52 RB10.1 19.29,85.43 15.82,85.43 RF1.1 15.73,85.52 15.29,85.52 10.4,90.41 10.4,92.99 CT9.P$2
N$5
  Top 0.203: R4.1 6.04,92.72 3.73,92.72 LED2.A
N$6
  Top 0.203: R5.1 5.96,96.63 3.73,96.63 LED3.A
N$7
  Bottom 0.203: ESP12.GPIO0 52.27,36.72 59.38,36.72 60.9,35.2 60.9,27.47 BOOT_ESP.1
N$8
  Top 0.203: RB2.1 31.65,88.46 31.65,85.61 RB11.1 31.56,85.43 28.45,85.43 RF2.1 28.27,85.43 28.09,85.43 23.11,90.41 23.11,92.99 CT8.P$2
N$10
  Top 0.203: RB3.1 44.45,88.19 RB12.1 44.45,85.52 41.6,85.52 RF3.1 41.52,85.52 40.72,85.52 35.83,90.41 35.83,92.99 CT7.P$2
N$11  (via drill 0.35)
  Top 0.203: v54.23,38.94 54.5,38.67 55.56,38.67 R6.1
  Bottom 0.203: v54.23,38.94 52.45,38.94 52.27,38.76 ESP12.GPIO2
N$13
  Top 0.203: PCB2.P$66 23.65,45.25 PCB2.P$26
N$16
  Top 0.203: SJ8.1 21.34,37.6 23.56,37.6 PCB2.P$72 23.65,37.69 25.07,37.69 PCB2.P$32
N$22
  Top 0.203: PCB2.P$41 29.16,75.74 27.65,75.74 PCB2.P$1
N$24
  Top 0.203: PCB2.P$57 29.16,55.47 27.65,55.47 PCB2.P$17
N$26
  Top 0.203: RB9.2 117.44,86.14 120.37,86.14 RB18.2 120.37,86.23 120.9,86.77 S1.1
N$27
  Top 0.203: RB8.2 104.19,86.41 107.04,86.41 RB17.2 107.04,86.5 108.01,87.48 108.01,88.72 S2.1
N$28
  Top 0.203: RB7.2 91.83,86.5 94.68,86.5 RB16.2 94.68,86.59 95.48,87.39 95.48,88.72 S3.1
N$29
  Top 0.203: Q1.2 80.37,20.71 81.61,20.71 83.3,19.02 R17.1 83.3,18.94 83.3,18.14 80.45,15.29 80.45,12.27 81.97,10.76 2POLE_MBUS.P$2 82.06,10.67 82.06,3.82 2POLE_MBUS.P$1
N$30
  Top 0.203: 90.32,28.8 90.32,29.6 R16.2 | 90.32,28.8 90.32,25.16 87.66,22.49 86.5,22.49 85.79,21.78 82.5,21.78 Q1.3 | 90.32,28.8 88.01,28.8 86.77,30.05 85.43,30.05 Q2.1
N$31
  Top 0.203: 86.77,25.51 86.77,23.56 86.94,23.38 R9.1 | 86.77,25.51 86.77,26.4 R14.2 | Q1.1 80.37,22.76 80.37,23.47 82.41,25.51 Q3.3 82.5,25.51 86.77,25.51
N$32
  Top 0.203: R11.1 86.5,16.45 87.83,16.45 88.72,17.34 R15.2 88.72,17.51 91.12,19.91 91.12,30.32 90.27,31.17 83.36,31.17 Q2.3 83.21,31.03 77.34,31.03 76.45,30.14 R19.1
N$33
  Top 0.203: Q3.1 80.19,26.58 77.88,26.58 R18.1
N$34
  Top 0.203: 112.55,52.9 111.84,52.9 RFV2.1 | 112.55,52.9 113.35,52.9 RVPU2.1 | 112.55,52.9 112.55,56.1 RVPU22.1
N$37
  Top 0.203: 112.37,43.2 113.08,43.2 RVPU1.1 | 112.37,43.2 111.66,43.2 RFV1.1 | 112.37,43.2 112.37,46.49 RVPU11.1
N$38
  Top 0.203: 58.14,85.08 57.61,84.54 56.9,84.54 55.92,85.52 54.14,85.52 RF4.1 54.5,85.61 54.5,90.86 52.36,92.99 48.54,92.99 CT6.P$2 | 58.14,85.08 58.14,87.66 RB4.1 | 58.14,85.08 67.47,85.08 68.01,84.54 70.41,84.54 71.56,85.7 76.9,85.7 77.08,85.52 82.77,85.52 RB15.1
N$39
  Top 0.203: 69.61,85.97 66.85,85.97 RF5.1 66.76,86.06 65.52,86.06 61.25,90.32 61.25,92.99 CT5.P$2 | RB14.1 69.61,85.97 | RB5.1 70.05,88.37 70.05,86.5 69.61,86.06 69.61,85.97
N$40
  Top 0.203: RB6.1 82.77,88.37 80.81,86.41 79.3,86.41 RF6.1 79.21,86.5 77.79,86.5 73.88,90.41 73.88,92.99 CT4.P$2 73.79,93.08 72.9,93.97 69.7,93.97 69.08,93.34 64.28,93.34 62.85,94.77 59.65,94.77 59.47,94.59 59.47,90.86 57.96,89.34 56.72,89.34 56.45,89.08 56.45,87.92 57.25,87.12 57.25,85.52 RB13.1
N$41
  Top 0.203: R3.1 6.13,88.81 3.73,88.81 LED1.A
N$42
  Top 0.203: RF7.1 86.94,83.57 86.94,86.23 87.12,86.41 RB16.1 | RB7.1 90.06,86.5 87.21,86.5 RB16.1 | CT3.P$2 86.59,92.99 86.59,87.12 87.12,86.59 RB16.1
N$43
  Top 0.203: RF8.1 99.48,83.74 99.48,86.32 RB17.1 | RB8.1 102.41,86.32 99.57,86.32 RB17.1 | RB17.1 99.3,86.5 99.3,92.99 CT2.P$2
N$44
  Top 0.203: RB18.1 112.19,85.52 112.19,82.68 RF9.1 | RB9.1 115.66,86.14 112.81,86.14 RB18.1 | CT1.P$2 112.01,92.99 112.01,87.03 112.81,86.23 RB18.1
NRST  (via drill 0.35)
  Top 0.203: v72.45,56.9 71.3,56.9 STM32F303VB.14 | PCB2.P$69 29.16,40.18 27.65,40.18 PCB2.P$29
  Bottom 0.203: v72.45,56.9 72.45,57.43 76.23,61.21 | 76.23,61.21 79.92,64.9 80.63,64.9 81.08,65.34 81.08,74.41 UART_STM.6 | 97.92,31.87 88.9,40.89 STLINK.3 88.72,40.89 88.46,40.89 86.86,42.49 86.86,50.58 76.23,61.21 | 97.92,31.87 104.01,25.78 112.37,25.78 123.84,14.31 125.08,14.31 125.17,14.4 126.95,14.4 RST.2 | 97.92,31.87 91.92,25.87 91.39,25.87 77.17,40.09 65.52,40.09 65.16,39.74 34.23,39.74 33.87,40.09 27.65,40.09 PCB2.P$29
PC14
  Top 0.203: STM32F303VB.8 71.3,53.87 72.1,53.87 74.05,51.92 74.05,46.49 Y1.P$1
PC15  (via drill 0.35)
  Top 0.203: v74.77,49.07 74.77,51.74 72.1,54.41 71.3,54.41 STM32F303VB.9 | v76.19,47.65 77.34,46.49 Y1.P$4
  Bottom 0.203: v76.19,47.65 v74.77,49.07
PULSE1_RJ45  (via drill 0.35)
  Top 0.203: RJ45_1.6 16.27,16.09 18.67,18.49 18.67,21.34 C22.1 18.67,21.43 18.22,21.87 v18.22,49.43 | v33.07,56.1 41.07,56.1 44.01,53.16 51.12,53.16 52.36,54.41 55.74,54.41 STM32F303VB.67
  Bottom 0.203: v33.07,56.1 29.78,56.1 27.65,53.96 22.76,53.96 v18.22,49.43
PULSE2  (via drill 0.35)
  Top 0.203: v14.4,24.8 16.18,24.8 C20.1 | v53.07,55.38 55.74,55.38 STM32F303VB.65
  Bottom 0.203: v14.4,24.8 10.76,24.8 3POLE_5.P$4 10.67,24.8 3.82,24.8 3POLE_5.P$3 3.65,24.89 2.49,26.05 2.49,36.98 3.29,37.78 5.6,37.78 14.49,46.67 28,46.67 28.18,46.85 33.16,46.85 33.69,46.32 37.34,46.32 41.52,50.49 46.76,50.49 51.65,55.38 v53.07,55.38
PUSHIN_1  (via drill 0.35)
  Top 0.203: v93.26,12 90.68,14.58 C21.1 90.68,14.67 91.66,15.65 v91.66,26.4 | v67.47,47.47 67.47,48.63 STM32F303VB.96 | 3POLE_6.P$3 94.77,3.82 94.77,10.67 3POLE_6.P$4
  Bottom 0.203: v93.26,12 93.43,12 94.68,10.76 3POLE_6.P$4 | v67.47,47.47 65.34,47.47 65.25,47.56 64.72,47.56 64.45,47.3 64.45,46.76 70.76,40.45 77.61,40.45 v91.66,26.4
PUSHIN_2  (via drill 0.35)
  Top 0.203: C10.1 16.62,59.92 10.76,59.92 3POLE_2.P$4 | v34.49,57.52 52.18,57.52 52.72,56.98 55.74,56.98 STM32F303VB.62
  Bottom 0.203: v34.49,57.52 29.52,57.52 27.65,59.38 11.2,59.38 10.76,59.83 3POLE_2.P$4 10.67,59.83 3POLE_2.P$3
PUSHIN_3  (via drill 0.35)
  Top 0.203: C15.1 16.45,48.27 10.76,48.27 3POLE_3.P$4 | v42.76,55.3 51.65,55.3 52.72,56.36 55.74,56.36 STM32F303VB.63
  Bottom 0.203: v42.76,55.3 40.98,53.52 37.6,53.52 34.05,49.96 28.71,49.96 27.65,48.9 11.38,48.9 10.76,48.27 3POLE_3.P$4 10.67,48.18 3.73,48.18 3POLE_3.P$3
PUSHIN_4  (via drill 0.35)
  Top 0.203: C19.1 16.27,36.45 10.76,36.45 3POLE_4.P$4 | v44.18,54.23 51.12,54.23 52.81,55.92 55.74,55.92 STM32F303VB.64 | v34.31,47.21 33.78,47.21 v32.89,46.32
  Bottom 0.203: v44.18,54.23 37.16,47.21 v34.31,47.21 | v32.89,46.32 15.29,46.32 9.42,40.45 9.42,37.78 | 9.42,37.78 10.67,36.54 3POLE_4.P$4 | 3POLE_4.P$3 3.73,36.54 8.09,36.54 9.34,37.78 9.42,37.78
RPI_GPIO16  (via drill 0.35)
  Top 0.203: v56.98,53.78 56.98,57.96 56.54,58.41 55.83,58.41 STM32F303VB.59 | v38.94,40.63 31.91,33.6 26.14,33.6 25.16,32.63 PCB2.P$36 24.98,32.54 23.65,32.54 PCB2.P$76
  Bottom 0.203: v56.98,53.78 56.98,52.09 45.34,40.45 39.12,40.45 v38.94,40.63
RPI_GPIO20  (via drill 0.35)
  Top 0.203: v54.5,57.87 55.74,57.87 STM32F303VB.60 | v40.09,40.98 30.23,31.11 26.23,31.11 25.16,30.05 PCB2.P$38 24.98,30.05 23.65,30.05 PCB2.P$78
  Bottom 0.203: v54.5,57.87 54.5,50.14 45.34,40.98 v40.09,40.98
RST_ESP_1
  Top 0.203: UART_ESP.6 68.45,25.78 C1.2
RST_ESP_2  (via drill 0.35)
  Top 0.203: v57.87,27.91 58.67,28.71 64.01,28.71 65.08,27.65 68.36,27.65 C1.1 | v56.63,27.91 53.96,27.91 53.43,28.45 v37.78,28.45
  Bottom 0.203: v56.63,27.91 v57.87,27.91 | v37.78,28.45 36.09,28.45 35.92,28.63 ESP12.RESET
SCK  (via drill 0.35)
  Top 0.203: PCB2.P$68 23.65,42.76 25.07,42.76 PCB2.P$28 | 65.52,42.49 65.52,39.83 v65.79,39.56 | 65.52,42.49 65.52,48.63 STM32F303VB.92 | v87.39,42.76 83.48,42.76 83.21,42.49 65.52,42.49 | v33.6,43.74 33.87,43.74 34.85,42.76 43.47,42.76 v48.9,37.34
  Bottom 0.203: v65.79,39.56 65.52,39.56 65.16,39.2 55.3,39.2 53.7,37.6 50.67,37.6 50.41,37.34 | 50.41,37.34 50.41,33.96 51.65,32.72 52.18,32.72 ESP12.GPIO5 | v87.39,42.76 87.92,42.23 89.26,42.23 91.3,40.18 96.46,40.18 EXPANSION_MODULE.23 | v33.6,43.74 27.11,43.74 26.14,42.76 25.16,42.76 PCB2.P$28 | 50.41,37.34 v48.9,37.34
SDA  (via drill 0.35)
  Top 0.203: PCB2.P$27 27.65,42.76 29.16,42.76 PCB2.P$67 29.25,42.67 v33.87,38.05 | v65.96,49.96 65.96,48.72 STM32F303VB.93 | v60.9,40.27 60.9,37.96 v59.12,36.18
  Bottom 0.203: v65.96,49.96 65.96,49.34 60.9,44.27 v60.9,40.27 | v59.12,36.18 54.23,36.18 52.81,34.76 52.27,34.76 ESP12.GPIO4 52.81,34.67 54.05,33.43 54.05,32 53.78,31.74 50.67,31.74 44.81,37.6 34.31,37.6 v33.87,38.05
SPI3_CLK  (via drill 0.35)
  Top 0.203: v40.98,47.21 40.45,47.74 32.98,47.74 SJ7.1 | v52.81,49.25 56.81,49.25 57.25,49.7 58.32,49.7 58.5,49.52 58.5,48.72 STM32F303VB.78 | v37.78,37.07 37.78,37.87 40.63,40.72 v40.63,42.23
  Bottom 0.203: v52.81,49.25 50.76,47.21 v40.98,47.21 40.98,47.12 40.63,46.76 v40.63,42.23 | v37.78,37.07 37.43,36.72 35.92,36.72 ESP12.GPIO14
SPI3_CS  (via drill 0.35)
  Top 0.203: SJ8.2 20.45,37.6 20.45,44.63 23.56,47.74 PCB2.P$64 23.65,47.83 24.98,47.83 PCB2.P$24 25.16,47.74 26.14,46.76 29.6,46.76 36.09,40.27 v37.78,40.27 | v58.05,47.47 58.05,48.63 STM32F303VB.77
  Bottom 0.203: v58.05,47.47 52.9,47.47 45.52,40.09 37.96,40.09 v37.78,40.27
SPI3_CS_ESP  (via drill 0.35)
  Top 0.203: v54.23,40.72 55.56,40.72 R7.1 | v60.01,46.85 60.45,46.85 61.43,47.83 61.43,48.63 STM32F303VB.84
  Bottom 0.203: ESP12.GPIO15 52.27,40.72 v54.23,40.72 54.23,40.8 60.01,46.58 v60.01,46.85
SPI3_MISO  (via drill 0.35)
  Top 0.203: v19.91,40.72 19.91,46.05 22.76,48.9 25.16,48.9 26.14,49.87 26.14,50.32 27.2,51.38 32.36,51.38 32.89,50.85 32.89,50.32 SJ6.1 32.98,50.23 v33.78,49.43 | v58.94,51.3 58.94,48.72 STM32F303VB.79
  Bottom 0.203: v19.91,40.72 23.02,40.72 24.98,38.76 35.83,38.76 ESP12.GPIO12 | v58.94,51.3 58.94,54.23 54.76,58.41 54.14,58.41 46.58,50.85 41.34,50.85 37.16,46.67 34.05,46.67 33.78,46.94 v33.78,49.43
SPI3_MOSI  (via drill 0.35)
  Top 0.203: SJ5.1 32.98,52.63 36.72,48.9 41.43,48.9 v41.78,48.54 41.87,48.54 42.88,47.54 52.56,47.54 v53.16,46.94 | v58.59,46.94 59.47,47.83 59.47,48.63 STM32F303VB.80
  Bottom 0.203: v41.78,48.54 41.52,48.54 37.69,44.72 37.69,41.96 36.45,40.72 35.92,40.72 ESP12.GPIO13 | v53.16,46.94 v58.59,46.94
SPI_CLK  (via drill 0.35)
  Top 0.203: PCB2.P$23 27.65,47.83 29.16,47.83 PCB2.P$63 29.25,47.83 32,47.83 SJ7.2 32.09,47.65 32.09,46.05 35.03,43.12 43.92,43.12 52.98,34.05 v54.23,34.05 | v95.83,26.85 109.79,26.85 RFM69HCW.13
  Bottom 0.203: v95.83,26.85 93.43,26.85 92.1,25.51 63.03,25.51 62.32,26.23 60.45,26.23 59.12,27.56 59.12,33.78 58.85,34.05 v54.23,34.05
SWCLK
  Top 0.203: STM32F303VB.76 57.52,48.63 57.52,47.03 65.52,39.03 84.45,39.03 88.81,43.38 STLINK.2
SWDIO  (via drill 0.35)
  Top 0.203: v61.87,55.74 58.14,52.01 55.83,52.01 STM32F303VB.72 | v86.32,46.41 88.46,46.41 88.81,46.05 STLINK.1
  Bottom 0.203: v61.87,55.74 65.34,55.74 68.28,58.67 68.63,58.67 69.16,58.14 69.16,54.41 73.97,49.61 75.3,49.61 78.5,46.41 v86.32,46.41
UART1_RX
  Top 0.203: SJ11.1 20.8,68.1 23.56,68.1 PCB2.P$48 23.65,68.1 25.07,68.1 PCB2.P$8 | STM32F303VB.69 52.45,53.43 51.38,52.36 40.63,52.36 UART1.1
  Bottom 0.203: PCB2.P$8 25.16,68.1 25.6,68.1 27.03,66.67 29.25,66.67 39.83,56.1 42.76,56.1 43.29,55.56 43.29,55.03 40.63,52.36 UART1.1
UART1_TX
  Top 0.203: SJ12.1 20.8,65.61 23.56,65.61 PCB2.P$50 23.65,65.61 25.07,65.61 PCB2.P$10 | STM32F303VB.68 55.74,53.87 52.36,53.87 51.3,52.81 42.58,52.81 40.63,54.76 UART1.2
  Bottom 0.203: PCB2.P$10 25.16,65.52 26.14,65.52 27.56,64.1 31.29,64.1 40.54,54.85 UART1.2
UART_RX  (via drill 0.35)
  Top 0.203: v62.59,50.05 62.59,48.72 STM32F303VB.86 | v70.05,57.52 v67.83,55.3
  Bottom 0.203: v67.83,55.3 v62.59,50.05 | v70.05,57.52 72.01,57.52 79.74,65.25 80.45,65.25 80.72,65.52 80.72,72.45 79.92,73.25 79.92,75.56 80.63,76.28 84.28,76.28 86.06,74.5 UART_STM.4
UART_RX_ESP
  Bottom 0.203: ESP12.TXD0 52.27,28.71 54.85,28.71 SJ9.2 54.94,28.63 54.94,28.27 55.83,27.38 58.05,27.38 63.03,22.4 63.3,22.4 UART_ESP.4
UART_TX
  Top 0.203: STM32F303VB.26 69.52,64.28 70.94,64.28 79.3,72.63 81.7,72.63 83.48,74.41 UART_STM.5
UART_TX_ESP
  Bottom 0.203: ESP12.RXD0 52.27,30.76 54.85,30.76 SJ10.1 54.94,30.67 54.94,30.23 55.38,29.78 56.81,29.78 58.41,28.18 58.41,27.74 60.27,25.87 62.14,25.87 65.61,22.4 65.88,22.4 UART_ESP.5
USART3_RX  (via drill 0.35)
  Top 0.203: v56.63,29.16 56.63,35.38 v50.41,41.6 | v58.59,62.85 58.59,64.19 STM32F303VB.48
  Bottom 0.203: v56.63,29.16 56.19,28.71 55.83,28.71 SJ9.1 | v50.41,41.6 54.05,41.6 59.47,47.03 59.47,54.41 58.59,55.3 v58.59,62.85
USART3_TX  (via drill 0.35)
  Top 0.203: v58.59,42.85 v58.59,33.52 | v59.74,61.87 59.74,62.67 59.03,63.39 59.03,64.19 STM32F303VB.47
  Bottom 0.203: v58.59,33.52 55.83,30.76 SJ10.2 | v58.59,42.85 58.59,44.63 60.54,46.58 60.54,53.87 59.74,54.67 v59.74,61.87
VSIG1  (via drill 0.35)
  Top 0.203: RFV1.2 109.88,43.2 108.19,43.2 CFV1.2 108.01,43.2 99.83,51.38 v85.25,51.38 | v69.96,61.43 71.21,61.43 STM32F303VB.23
  Bottom 0.203: v69.96,61.43 69.96,58.23 69.52,57.78 69.52,57.25 75.39,51.38 v85.25,51.38
VSIG2  (via drill 0.35)
  Top 0.203: RFV2.2 110.06,52.9 108.28,52.9 CFV2.2 108.1,52.9 107.12,53.87 v90.68,53.87 | v83.48,61.07 81.43,63.12 73.7,63.12 72.54,61.96 71.3,61.96 STM32F303VB.24
  Bottom 0.203: v90.68,53.87 v83.48,61.07
VSIG3  (via drill 0.35)
  Top 0.203: RFV3.2 110.06,66.67 108.28,66.67 CFV3.2 108.1,66.67 v100.64,59.21 | v81.88,63.48 73.52,63.48 72.54,62.5 71.3,62.5 STM32F303VB.25
  Bottom 0.203: v81.88,63.48 86.14,59.21 v100.64,59.21

## Text on the board
tPlace: Designed in | North Wales | Made in UK
bPlace: Open Hardware
tNames: RST | TX | RX | 5V | VT3 | CLMP_1 | GND | CLMP_2 | VT2 | CLMP_3 | VREF / 3V3 | DIO | CLK | RST | CLMP_4 | VT1 | CN6009 MODULE | CLMP_5 | CLMP_6 | MBUS
bNames: v0.2a | OpenEnergyMonitor | Development Board | emonSTM32
tDocu: 128.905 x / 105.791 y